# Altium schematic sheet Main_Schematic.SchDoc: Title
size A4; Date: *******; ApprovedBy: *******; CheckedBy: Yasiru Banayake; Author: *******; CompanyName: *******; DrawnBy: Lasith Haputhanthri; Engineer: *******; Organization: *******; Address1: *******; Address2: *******; Address3: *******; Address4: *******; DocumentNumber: 1; Revision: *******; SheetNumber: 1; SheetTotal: 11; Subtitle: Main Schematic; Project: Resturant Robot; VersionRevision: III; TotalSheet: 11; CurrentTime: *******; CurrentDate: *******; Time: *******; DocumentFullPathAndName: *******; DocumentName: *******; ModifiedDate: *******; ImagePath: *******; ProjectName: *******; Application_BuildNumber: *******
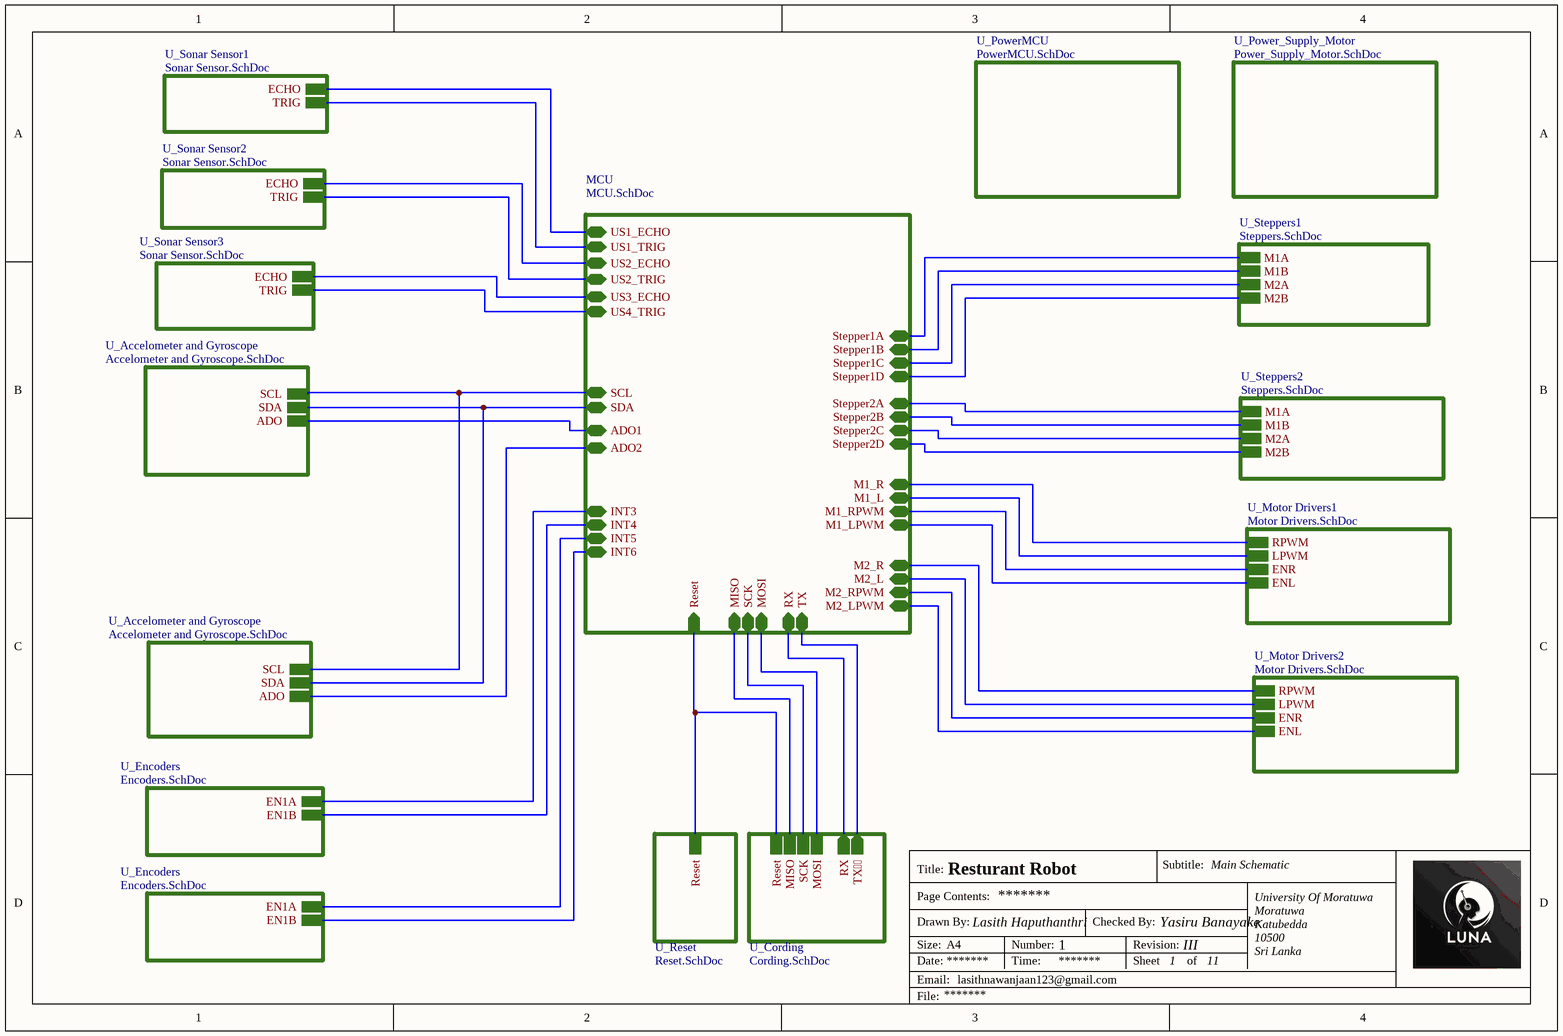
[diagram p0: Main_Schematic.SchDoc]

## Sub-sheets
MCU = MCU.SchDoc: Reset (in), INT3 (bidir), INT4 (bidir), INT5 (bidir), INT6 (bidir), SCL (bidir), SDA (bidir), M1_RPWM (bidir), M1_LPWM (bidir), M2_RPWM (bidir), M2_LPWM (bidir), ADO1 (bidir), ADO2 (bidir), M1_R (bidir), M1_L (bidir), M2_R (bidir), M2_L (bidir), Stepper1A (bidir), Stepper1B (bidir), Stepper1C (bidir), Stepper1D (bidir), Stepper2C (bidir), Stepper2A (bidir), Stepper2B (bidir), Stepper2D (bidir), TX (bidir), RX (bidir), SCK (bidir), MOSI (bidir), MISO (bidir), US1_ECHO (bidir), US1_TRIG (bidir), US2_ECHO (bidir), US2_TRIG (bidir), US3_ECHO (bidir), US4_TRIG (bidir)
U_Accelometer and Gyroscope = Accelometer and Gyroscope.SchDoc: SCL, SDA, ADO
U_Accelometer and Gyroscope = Accelometer and Gyroscope.SchDoc: SCL, SDA, ADO
U_Cording = Cording.SchDoc: MOSI, Reset, SCK, MISO, RX (out), TX (out)
U_Encoders = Encoders.SchDoc: EN1A, EN1B
U_Encoders = Encoders.SchDoc: EN1A, EN1B
U_Motor Drivers1 = Motor Drivers.SchDoc: RPWM, LPWM, ENR, ENL
U_Motor Drivers2 = Motor Drivers.SchDoc: RPWM, LPWM, ENR, ENL
U_Power_Supply_Motor = Power_Supply_Motor.SchDoc: no entries
U_PowerMCU = PowerMCU.SchDoc: no entries
U_Reset = Reset.SchDoc: Reset
U_Sonar Sensor1 = Sonar Sensor.SchDoc: ECHO, TRIG
U_Sonar Sensor2 = Sonar Sensor.SchDoc: ECHO, TRIG
U_Sonar Sensor3 = Sonar Sensor.SchDoc: ECHO, TRIG
U_Steppers1 = Steppers.SchDoc: M1A, M1B, M2A, M2B
U_Steppers2 = Steppers.SchDoc: M1A, M1B, M2A, M2B

## Nets
(unnamed): sheet MCU/Reset, sheet U_Reset/Reset, sheet U_Cording/Reset
(unnamed): sheet MCU/INT3, sheet U_Encoders/EN1A
(unnamed): sheet MCU/INT4, sheet U_Encoders/EN1B
(unnamed): sheet MCU/INT5, sheet U_Encoders/EN1A
(unnamed): sheet MCU/INT6, sheet U_Encoders/EN1B
(unnamed): sheet MCU/SCL, sheet U_Accelometer and Gyroscope/SCL, sheet U_Accelometer and Gyroscope/SCL
(unnamed): sheet MCU/SDA, sheet U_Accelometer and Gyroscope/SDA, sheet U_Accelometer and Gyroscope/SDA
(unnamed): sheet MCU/M1_RPWM, sheet U_Motor Drivers1/ENR
(unnamed): sheet MCU/M1_LPWM, sheet U_Motor Drivers1/ENL
(unnamed): sheet MCU/M2_RPWM, sheet U_Motor Drivers2/ENR
(unnamed): sheet MCU/M2_LPWM, sheet U_Motor Drivers2/ENL
(unnamed): sheet MCU/ADO1, sheet U_Accelometer and Gyroscope/ADO
(unnamed): sheet MCU/ADO2, sheet U_Accelometer and Gyroscope/ADO
(unnamed): sheet MCU/M1_R, sheet U_Motor Drivers1/RPWM
(unnamed): sheet MCU/M1_L, sheet U_Motor Drivers1/LPWM
(unnamed): sheet MCU/M2_R, sheet U_Motor Drivers2/RPWM
(unnamed): sheet MCU/M2_L, sheet U_Motor Drivers2/LPWM
(unnamed): sheet MCU/Stepper1A, sheet U_Steppers1/M1A
(unnamed): sheet MCU/Stepper1B, sheet U_Steppers1/M1B
(unnamed): sheet MCU/Stepper1C, sheet U_Steppers1/M2A
(unnamed): sheet MCU/Stepper1D, sheet U_Steppers1/M2B
(unnamed): sheet MCU/Stepper2C, sheet U_Steppers2/M2A
(unnamed): sheet MCU/Stepper2A, sheet U_Steppers2/M1A
(unnamed): sheet MCU/Stepper2B, sheet U_Steppers2/M1B
(unnamed): sheet MCU/Stepper2D, sheet U_Steppers2/M2B
(unnamed): sheet MCU/TX, sheet U_Cording/TX
(unnamed): sheet MCU/RX, sheet U_Cording/RX
(unnamed): sheet MCU/SCK, sheet U_Cording/SCK
(unnamed): sheet MCU/MOSI, sheet U_Cording/MOSI
(unnamed): sheet MCU/MISO, sheet U_Cording/MISO
(unnamed): sheet MCU/US1_ECHO, sheet U_Sonar Sensor1/ECHO
(unnamed): sheet MCU/US1_TRIG, sheet U_Sonar Sensor1/TRIG
(unnamed): sheet MCU/US2_ECHO, sheet U_Sonar Sensor2/ECHO
(unnamed): sheet MCU/US2_TRIG, sheet U_Sonar Sensor2/TRIG
(unnamed): sheet MCU/US3_ECHO, sheet U_Sonar Sensor3/ECHO
(unnamed): sheet MCU/US4_TRIG, sheet U_Sonar Sensor3/TRIG

## Notes on the sheet
- Title:
- Drawn By:
- Page Contents:
- Checked By:
- Subtitle:
- University Of Moratuwa
- Moratuwa
- Size:
- Date:
- File:
- Email:
- A4
- lasithnawanjaan123@gmail.com
- Lasith Haputhanthri
- Number:
- Time:
- Revision:
- Sheet
- of
- Katubedda
- 10500
- Sri Lanka